# Altium project PCB_Project_HydroPore.PrjPcb
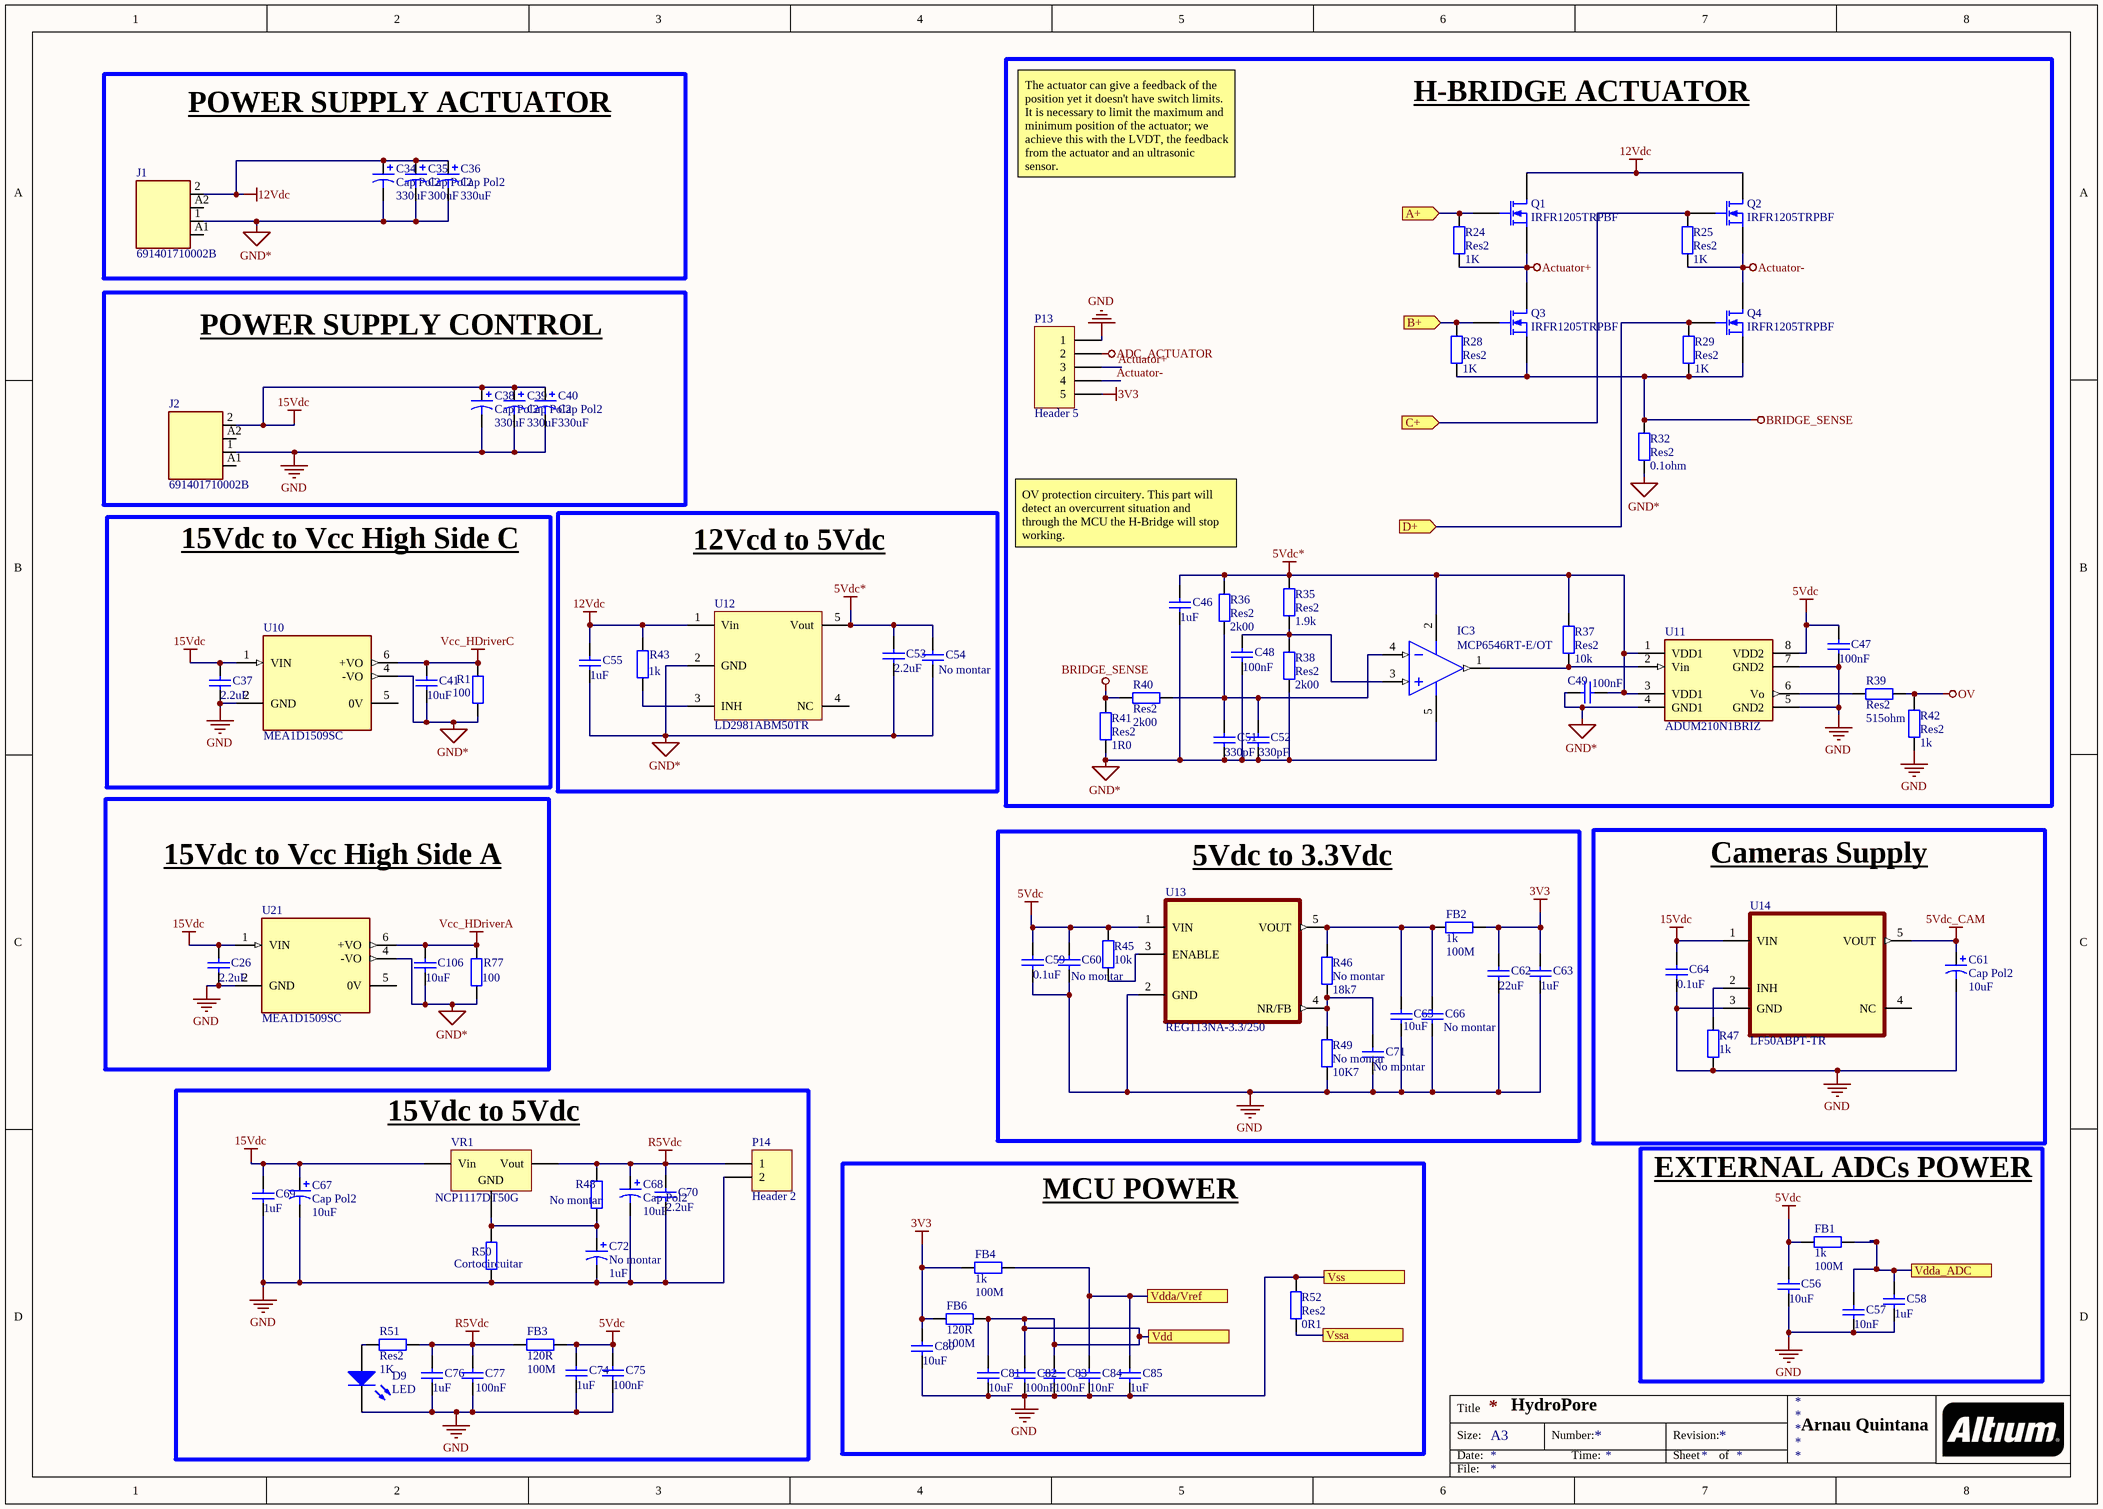
[diagram p0: Power.SchDoc]
3 sheets, 268 parts. Net scope: flat (ports and power ports of the same name join across sheets).
Board file: PCB_HydroPore.PcbDoc
Sheets:
  Power.SchDoc
  MCU.SchDoc
  Sensors.SchDoc

## Sheet Power.SchDoc
size A3

### Parts
C26  value 2.2uF  [0603 - duplicate]  (hidden comment: Cap)
C34  Cap Pol2  value 330uF  [ElectrolythicCap_5mm]
C35  Cap Pol2  value 300uF  [ElectrolythicCap_5mm]
C36  Cap Pol2  value 330uF  [ElectrolythicCap_5mm]
C37  value 2.2uF  [0603 - duplicate]  (hidden comment: Cap)
C38  Cap Pol2  value 330uF  [ElectrolythicCap_5mm]
C39  Cap Pol2  value 330uF  [ElectrolythicCap_5mm]
C40  Cap Pol2  value 330uF  [ElectrolythicCap_5mm]
C41  value 10uF  [0603 - duplicate]  (hidden comment: Cap)
C46  value 1uF  [0603 - duplicate]  (hidden comment: Cap)
C47  value 100nF  [0603 - duplicate]  (hidden comment: Cap)
C48  value 100nF  [0603 - duplicate]  (hidden comment: Cap)
C49  value 100nF  [0603 - duplicate]  (hidden comment: Cap)
C51  value 330pF  [0603 - duplicate]  (hidden comment: Cap)
C52  value 330pF  [0603 - duplicate]  (hidden comment: Cap)
C53  value 2.2uF  [0603 - duplicate]  (hidden comment: Cap)
C54  No montar  [0603 - duplicate]
C55  value 1uF  [0603 - duplicate]  (hidden comment: Cap)
C56  value 10uF  [0603 - duplicate]  (hidden comment: Cap)
C57  value 10nF  [0603 - duplicate]  (hidden comment: Cap)
C58  value 1uF  [0603 - duplicate]  (hidden comment: Cap)
C59  value 0.1uF  [0603 - duplicate]  (hidden comment: Cap)
C60  No montar  [0603 - duplicate]
C61  Cap Pol2  value 10uF  [ElectrolythicCap_2mm]
C62  value 22uF  [0603 - duplicate]  (hidden comment: Cap)
C63  value 1uF  [0603 - duplicate]  (hidden comment: Cap)
C64  value 0.1uF  [0603 - duplicate]  (hidden comment: Cap)
C65  10uF  [0603 - duplicate]
C66  No montar  [0603 - duplicate]
C67  Cap Pol2  value 10uF  [ElectrolythicCap_2mm]
C68  Cap Pol2  value 10uF  [ElectrolythicCap_2mm]
C69  value 1uF  [0603 - duplicate]  (hidden comment: Cap)
C70  value 2.2uF  [0603 - duplicate]  (hidden comment: Cap)
C71  value No montar  [0603 - duplicate]  (hidden comment: 0.01uF)
C72  No montar  value 1uF  [ElectrolythicCap_2mm]
C74  value 1uF  [0603 - duplicate]  (hidden comment: Cap)
C75  value 100nF  [0603 - duplicate]  (hidden comment: Cap)
C76  value 1uF  [0603 - duplicate]  (hidden comment: Cap)
C77  value 100nF  [0603 - duplicate]  (hidden comment: Cap)
C80  value 10uF  [0603 - duplicate]  (hidden comment: Cap)
C81  value 10uF  [0603 - duplicate]  (hidden comment: Cap)
C82  value 100nF  [0603 - duplicate]  (hidden comment: Cap)
C83  value 100nF  [0603 - duplicate]  (hidden comment: Cap)
C84  value 10nF  [0603 - duplicate]  (hidden comment: Cap)
C85  value 1uF  [0603 - duplicate]  (hidden comment: Cap)
C106  value 10uF  [0603 - duplicate]  (hidden comment: Cap)
D9  LED  [LED 1206]
FB1  1k  value 100M  [0603 - duplicate]
FB2  1k  value 100M  [0603 - duplicate]
FB3  120R  value 100M  [0603 - duplicate]
FB4  1k  value 100M  [0603 - duplicate]
FB6  120R  value 100M  [0603 - duplicate]
IC3  MCP6546RT-E/OT  [SOT23-5_N]
J1  691401710002B  [691401710002B]
J2  691401710002B  [691401710002B]
P13  Header 5  [regleta_5]
P14  Header 2  [HDR1X2]
Q1  IRFR1205TRPBF  [Infineon_PG-TO252-3_MFG]
Q2  IRFR1205TRPBF  [Infineon_PG-TO252-3_MFG]
Q3  IRFR1205TRPBF  [Infineon_PG-TO252-3_MFG]
Q4  IRFR1205TRPBF  [Infineon_PG-TO252-3_MFG]
R1  100  [1206]
R24  Res2  value 1K  [0603 - duplicate]
R25  Res2  value 1K  [0603 - duplicate]
R28  Res2  value 1K  [0603 - duplicate]
R29  Res2  value 1K  [0603 - duplicate]
R32  Res2  value 0.1ohm  [1206]
R35  Res2  value 1.9k  [0603 - duplicate]
R36  Res2  value 2k00  [0603 - duplicate]
R37  Res2  value 10k  [0603 - duplicate]
R38  Res2  value 2k00  [0603 - duplicate]
R39  Res2  value 515ohm  [0603 - duplicate]
R40  Res2  value 2k00  [0603 - duplicate]
R41  Res2  value 1R0  [1206]
R42  Res2  value 1k  [0603 - duplicate]
R43  1k  [0603 - duplicate]
R45  10k  [0603 - duplicate]
R46  No montar  value 18k7  [0603 - duplicate]
R47  1k  [0603 - duplicate]
R48  No montar  [0603 - duplicate]
R49  No montar  value 10K7  [0603 - duplicate]
R50  Cortocircuitar  [0603 - duplicate]
R51  Res2  value 1K  [0603 - duplicate]
R52  Res2  value 0R1  [0603 - duplicate]
R77  100  [1206]
U10  MEA1D1509SC  [CONV_MEA1D1509SC]
U11  ADUM210N1BRIZ  [SOIC127P1031X265-8N]
U12  LD2981ABM50TR  [SOT23-5_N]
U13  REG113NA-3.3/250  [SOT23-5_N]
U14  LF50ABPT-TR  [DPAK114P990X239-6N]
U21  MEA1D1509SC  [CONV_MEA1D1509SC]
VR1  NCP1117DT50G  [D2PAK_N]

### Blocks framed on the sheet
H-BRIDGE ACTUATOR: C46-C49 C51 C52 IC3 P13 Q1-Q4 R24 R25 R28 R29 R32 R35-R42 U11
POWER SUPPLY ACTUATOR: C34-C36 J1
POWER SUPPLY CONTROL: C38-C40 J2
15Vdc to Vcc High Side C: C37 C41 R1 U10
12Vcd to 5Vdc: C53-C55 R43 U12
15Vdc to Vcc High Side A: C26 C106 R77 U21
5Vdc to 3.3Vdc: C59 C60 C62 C63 C65 C66 C71 FB2 R45 R46 R49 U13
Cameras Supply: C61 C64 R47 U14
15Vdc to 5Vdc: C67-C70 C72 C74-C77 D9 FB3 P14 R48 R50 R51 VR1
EXTERNAL ADCs POWER: C56-C58 FB1
MCU POWER: C80-C85 FB4 FB6 R52

### Ports
A+ (in), B+ (in), C+ (in), D+ (in), Vdd, Vdda/Vref, Vdda_ADC, Vss, Vssa

### Nets
3V3: C62.2 C63.2 C80.2 FB2.2 FB4.1 FB6.1 P13.5
5Vdc: C47.2 C56.2 C59.2 C60.2 C74.2 C75.2 FB1.1 FB3.2 R45.2 U11.8(VDD2) U13.1(VIN)
5Vdc*: C46.2 C49.1 C53.2 C54.2 IC3.2(V+) R35.1 R36.1 R37.2 U11.1(VDD1) U11.3(VDD1) U12.5(Vout)
5Vdc_CAM: C61.P U14.5(VOUT)
12Vdc: C34.P C35.P C36.P C55.2 J1.2 Q1.2(D) Q2.2(D) R43.2 U12.1(Vin)
15Vdc: C26.2 C37.2 C38.P C39.P C40.P C64.2 C67.P C69.2 J2.2 U10.1(VIN) U14.1(VIN) U21.1(VIN) VR1.3(Vin)
Actuator+: P13.3 Q1.3(S) Q3.2(D) R24.1
Actuator-: P13.4 Q2.3(S) Q4.2(D) R25.1
ADC_ACTUATOR: P13.2
BRIDGE_SENSE: Q3.3(S) Q4.3(S) R28.1 R29.1 R32.2 R40.1 R41.2
GND: C26.1 C37.1 C38.N C39.N C40.N C47.1 C56.1 C57.1 C58.1 C59.1 C60.1 C61.N C62.1 C63.1 C64.1 C65.1 C66.1 C67.N C68.N C69.1 C70.1 C71.1 C72.N C74.1 C75.1 C76.1 C77.1 C80.1 C81.1 C82.1 C83.1 C84.1 C85.1 D9.2(K) J2.1 P13.1 P14.2 R42.2 R47.1 R49.1 R50.1 R52.2 U10.2(GND) U11.5(GND2) U11.7(GND2) U13.2(GND) U14.3(GND) U21.2(GND) ; port Vss
GND*: C34.N C35.N C36.N C41.1 C46.1 C48.1 C49.2 C51.1 C52.1 C53.1 C54.1 C55.1 C106.1 IC3.5(V-) J1.1 R1.1 R32.1 R38.2 R41.1 R77.1 U10.4(-VO) U11.4(GND1) U12.2(GND) U21.4(-VO)
OV: R39.1 R42.1
R5Vdc: C68.P C70.2 C76.2 C77.2 FB3.1 P14.1 R48.2 R51.2 VR1.2(Vout)
Vcc_HDriverA: C106.2 R77.2 U21.6(+VO)
Vcc_HDriverC: C41.2 R1.2 U10.6(+VO)
NetC42_2: C57.2 C58.2 FB1.2 ; port Vdda_ADC
NetC48_2: C48.2 IC3.3(IN+) R35.2 R38.1
NetC51_2: C51.2 C52.2 IC3.4(IN-) R36.2 R40.2
NetC65_2: C65.2 C66.2 FB2.1 R46.2 U13.5(VOUT)
NetC71_2: C71.2 R46.1 R49.2 U13.4(NR/FB)
NetC72_P: C72.P R48.1 R50.2 VR1.1(GND)
NetC81_2: C81.2 C82.2 C83.2 FB6.2 ; port Vdd
NetC84_2: C84.2 C85.2 FB4.2 ; port Vdda/Vref
NetD5_1: Q3.1(G) R28.2 ; port B+
NetD6_1: Q1.1(G) R24.2 ; port A+
NetD7_1: Q2.1(G) R25.2 ; port C+
NetD8_1: Q4.1(G) R29.2 ; port D+
NetD9_1: D9.1(A) R51.1
NetIC3_1: IC3.1(OUT) R37.1 U11.2(Vin)
NetR39_2: R39.2 U11.6(Vo)
NetR43_1: R43.1 U12.3(INH)
NetR45_1: R45.1 U13.3(ENABLE)
NetR47_2: R47.2 U14.2(INH)
NetR52_1: R52.1 ; port Vssa

Not connected (* = marked no-connect by the designer): J1 A1(2) A2(1); J2 A1(2) A2(1); U10 5(0V); U12 4(NC); U14 4(NC); U21 5(0V)

### Notes on the sheet
- The actuator can give a feedback of the position yet it doesn't have switch limits. It is necessary to limit the maximum and minimum position of the actuator; we achieve this with the LVDT, the feedback from the actuator and an ultrasonic sensor.
- OV protection circuitery. This part will detect an overcurrent situation and through the MCU the H-Bridge will stop working.
- (near U14) Cameras use their own LDO, every one of them have a consume of 100mA more less, so just for ensure a correct working we separate supplies.
- (near FB4) MCU is a critical component, before connect the 3.3V supply we need to filter and ensure that uC will not be without supply in any moment using a good number of capacitors.
- HydroPore
- Arnau Quintana
- Title
- Size:
- Date:
- A3
- Number:
- Time:
- Revision:
- Sheet
- of
- File:

### Library data of the parts
C26 C37 C41 C46-C49 C51-C60 C62-C66 C69-C71 C74-C77 C80-C85 C106 = Cap: Capacitor; Published: 8-Jun-2000; LatestRevisionDate: 17-Jul-2002; LatestRevisionNote: Re-released for DXP Platform.; PackageReference: RAD-0.3; Publisher: Altium Limited; PackageDescription: Radial Cap, Thru-Hole; 2 Leads; 0.3 in Pin Spacing
C34-C36 C38-C40 C61 C67 C68 C72 = Cap Pol2: Polarized Capacitor (Axial); Published: 8-Jun-2000; LatestRevisionDate: 17-Jul-2002; LatestRevisionNote: Re-released for DXP Platform.; PackageReference: POLAR0.8; Publisher: Altium Limited; PackageDescription: Polarized Capacitor; 2 Leads
D9 = LED: Typical RED, GREEN, YELLOW, AMBER GaAs LED; Published: 8-Jun-2000; LatestRevisionDate: 17-Jul-2002; LatestRevisionNote: Re-released for DXP Platform.; PackageVersion: Feb-2002; PackageReference: 3.2X1.6X1.1; Publisher: Altium Limited; PackageDescription: SM LED; 2 Flat Leads
FB1-FB4 FB6 R1 R24 R25 R28 R29 R32 R35-R43 R45-R52 R77 = Res2: Resistor; Published: 8-Jun-2000; LatestRevisionDate: 17-Jul-2002; LatestRevisionNote: Re-released for DXP Platform.; PackageReference: AXIAL-0.4; Publisher: Altium Limited; PackageDescription: Axial Device, Thru-Hole; 2 Leads; 0.4 in Pin Spacing
IC3 = MCP6546RT-E/OT: Operational Amplifier; Published: 8-Jun-2000; LatestRevisionDate: 17-Jul-2002; LatestRevisionNote: Re-released for DXP Platform.; DatasheetVersion: REV. B; PackageVersion: 1990; PackageReference: H-08A; Publisher: Altium Limited; PackageDescription: Can; 8 Leads; Pin Circle Dia. 5.08 mm; Lead Dia. 0.53 mm (max); ComponentLink1Description: Manufacturer Link; ComponentLink1URL: http://www.analog.com/
J1 J2 = 691401710002B: <b>WR-TBL Terminal block - serie 401 5,0mm - Spring clamp/Screw less - horizontal entry ; </b>=>Code : Con_TBL_Screwless_5.00_6914017100xxB <p><a href="http://katalog.we-online.de/media/images/eican/Con_TBL_Screwless_5.00_6914017100xxB_pf2.jpg"> <img src="http://katalog.we-online.de/media/thumbs2/eican/thb_Con_TBL_Screwless_5.00_6914017100xxB_pf2.jpg" width="320"></a><p> <p>Details see: <a href="http://katalog.we-online.de/en/em/TBL_5_00_401B_SCREWLESS_HORIZONTAL_ENTRY_2_0MM2_WIRES_6914017100XXB">http://katalog.we-online.de/en/em/TBL_5_00_401B_SCREWLESS_HORIZONTAL_ENTRY_2_0MM2_WIRES_6914017100XXB</a> <p>Created 11/27/2014, Karrer Zheng <p>2014 (C) Wurth Elektronik; MF: WÃ¼rth Elektronik; Package: None; Value: *; Purchase-URL: https://pricing.snapeda.com/search/part/691401710002B/?ref=eda; Availability: In Stock; SnapEDA_Link: https://www.snapeda.com/parts/691401710002B/Wurth+Electronics+Inc./view-part/?ref=snap; Price: None; MP: 691401710002B; Check_prices: https://www.snapeda.com/parts/691401710002B/Wurth+Electronics+Inc./view-part/?ref=eda
P13 = Header 5: Header, 5-Pin; LatestRevisionDate: 17-Jul-2002; LatestRevisionNote: Re-released for DXP Platform.; Publisher: Altium Limited
P14 = Header 2: Header, 2-Pin; LatestRevisionDate: 17-Jul-2002; LatestRevisionNote: Re-released for DXP Platform.; Publisher: Altium Limited
Q1-Q4 = IRFR1205TRPBF: N-Channel MOSFET; Published: 8-Jun-2000; LatestRevisionDate: 17-Jul-2002; LatestRevisionNote: Re-released for DXP Platform.; PackageVersion: 1995/1996; PackageReference: E3; Publisher: Altium Limited; PackageDescription: TO, Flat Index; 3 In-Line, Axial Leads; Body Dia. 4.6mm; Lead Dia. 0.5 mm (max)
U10 U21 = MEA1D1509SC: 1 W, Dual Independent Output, 7 Pin SIP, 4200 Vdc Isolation, Dc-Dc Converter; MP: VQA-S15-D15-SIP; MF: CUI Inc.; Mouser-Purchase-URL: https://snapeda.com/shop?store=Mouser&id=1237682; Price: None; SnapEDA_Link: https://www.snapeda.com/parts/VQA-S15-D15-SIP/CUI/view-part/1237682/?ref=snap; Availability: Bad; Arrow_Electronics-Purchase-URL: https://snapeda.com/shop?store=Arrow+Electronics&id=1237682; Value: *; CUI_purchase_URL: https://www.cui.com/product/dc-dc-converters/igbt-driver/vqa-series?utm_source=snapeda.com&utm_medium=referral&utm_campaign=snapedaBOM; Package: SIP-7 CUI
U11 = ADUM210N1BRIZ: Digital Isolator; MP: PEME2-S15-D5-S; MF: CUI; Purchase-URL: https://pricing.snapeda.com/search/part/PEME2-S15-D5-S/?ref=eda; Package: None; Value: *; SnapEDA_Link: https://www.snapeda.com/parts/PEME2-S15-D5-S/CUI/view-part/?ref=snap; Availability: In Stock; Price: None; Check_prices: https://www.snapeda.com/parts/PEME2-S15-D5-S/CUI/view-part/?ref=eda
U13 = REG113NA-3.3/250: Dropout Linear  Regulator; MP: LP3964EMP-ADJ; Package: None; Price: None; Value: *; Availability: Unavailable
U14 = LF50ABPT-TR: Dropout Linear  Regulator; MP: LP3964EMP-ADJ; Package: None; Price: None; Value: *; Availability: Unavailable
VR1 = Volt Reg: Published: 24-Mar-1999; LatestRevisionDate: 29-May-2009; LatestRevisionNote: IPC-7351 Footprint Added.; PackageReference: D2PAK; Publisher: Altium Limited; PackageDescription: 3-Pin Transistor Outline Package 2.54 mm Pitch, 15.1 mm Lead Span
U12 = LD2981ABM50TR: Published: 8-Jun-2000; LatestRevisionDate: 29-May-2009; LatestRevisionNote: IPC-7351 Footprint Added.; PackageVersion: May-1999; PackageReference: DB008; Publisher: Altium Limited; PackageDescription: 8-Pin Plastic Small Outline Package 0.65 mm Pitch; Code_JEDEC: MO-150-AA; Code_IPC: SOP65P780-8

## Sheet MCU.SchDoc
size A3; Organization: Altium Limited; Address1: L3, 12a Rodborough Rd; Address2: Frenchs Forest; Address3: NSW; Address4: Australia 2086
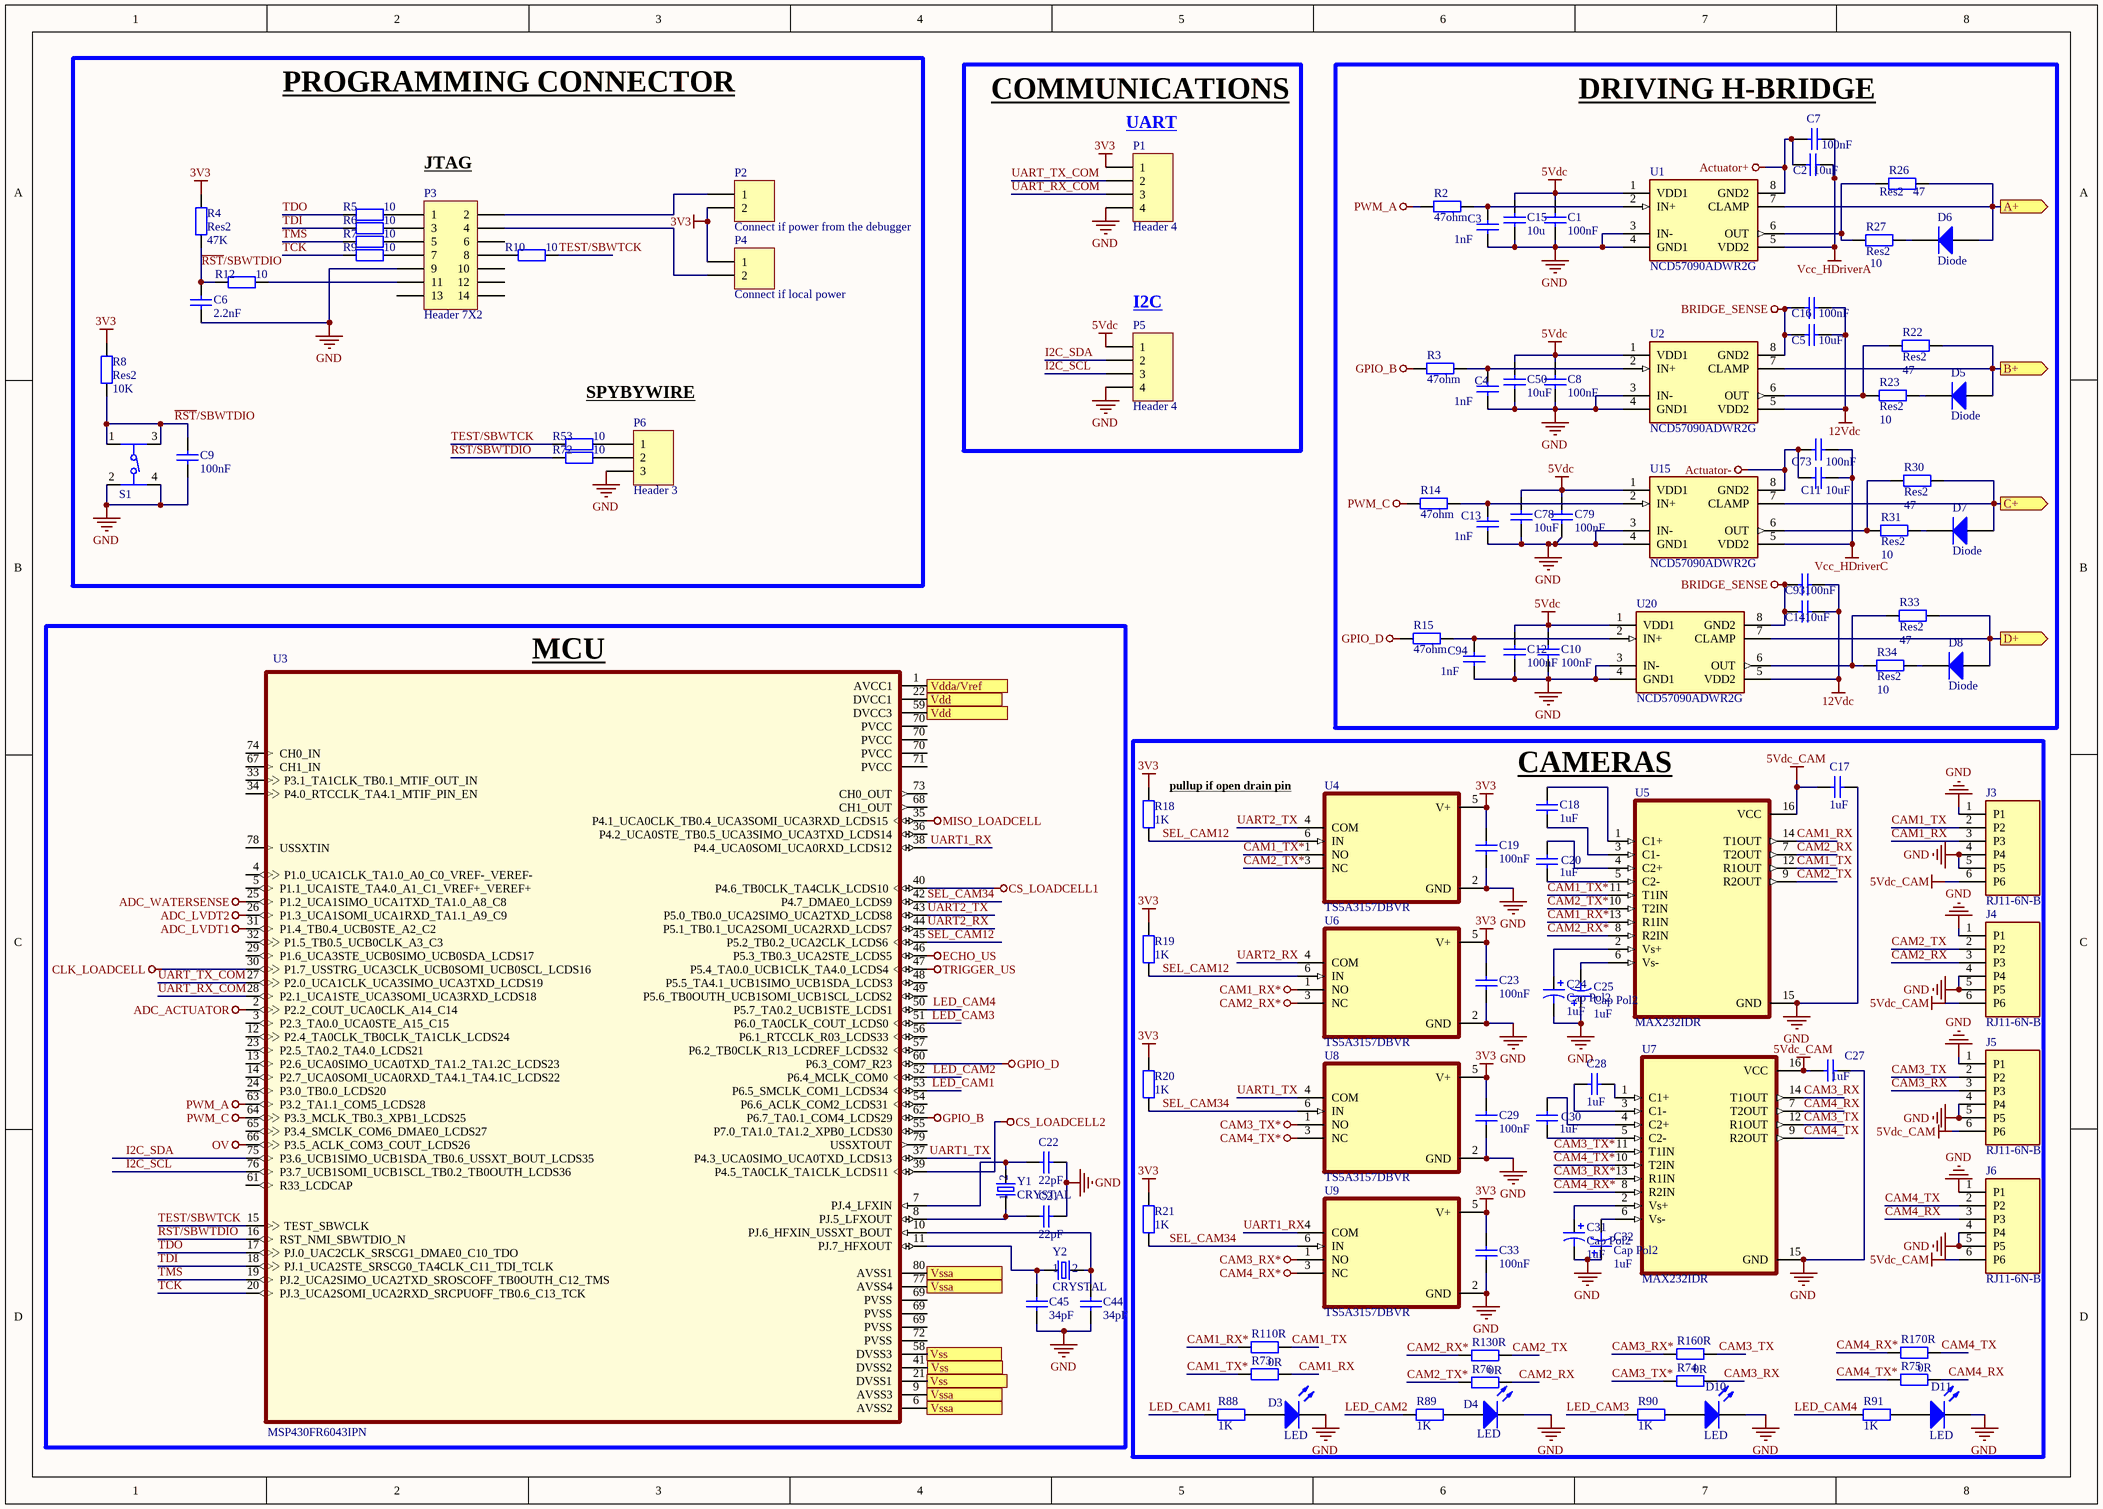
[diagram p1: MCU.SchDoc]

### Parts
C1  value 100nF  [1206]  (hidden comment: Cap)
C2  value 10uF  [1206]  (hidden comment: Cap)
C3  value 1nF  [0603 - duplicate]  (hidden comment: Cap)
C4  value 1nF  [0603 - duplicate]  (hidden comment: Cap)
C5  value 10uF  [1206]  (hidden comment: Cap)
C6  value 2.2nF  [0603 - duplicate]  (hidden comment: Cap)
C7  value 100nF  [1206]  (hidden comment: Cap)
C8  value 100nF  [1206]  (hidden comment: Cap)
C9  value 100nF  [0603 - duplicate]  (hidden comment: Cap)
C10  value 100nF  [1206]  (hidden comment: Cap)
C11  value 10uF  [1206]  (hidden comment: Cap)
C12  value 100nF  [1206]  (hidden comment: Cap)
C13  value 1nF  [0603 - duplicate]  (hidden comment: Cap)
C14  value 10uF  [1206]  (hidden comment: Cap)
C15  value 10u  [1206]  (hidden comment: Cap)
C16  value 100nF  [1206]  (hidden comment: Cap)
C17  value 1uF  [0603 - duplicate]  (hidden comment: Cap)
C18  value 1uF  [0603 - duplicate]  (hidden comment: Cap)
C19  value 100nF  [0603 - duplicate]  (hidden comment: Cap)
C20  value 1uF  [0603 - duplicate]  (hidden comment: Cap)
C21  value 22pF  [0603 - duplicate]  (hidden comment: Cap)
C22  value 22pF  [0603 - duplicate]  (hidden comment: Cap)
C23  value 100nF  [0603 - duplicate]  (hidden comment: Cap)
C24  Cap Pol2  value 1uF  [ElectrolythicCap_2mm]
C25  Cap Pol2  value 1uF  [ElectrolythicCap_2mm]
C27  value 1uF  [0603 - duplicate]  (hidden comment: Cap)
C28  value 1uF  [0603 - duplicate]  (hidden comment: Cap)
C29  value 100nF  [0603 - duplicate]  (hidden comment: Cap)
C30  value 1uF  [0603 - duplicate]  (hidden comment: Cap)
C31  Cap Pol2  value 1uF  [ElectrolythicCap_2mm]
C32  Cap Pol2  value 1uF  [ElectrolythicCap_2mm]
C33  value 100nF  [0603 - duplicate]  (hidden comment: Cap)
C44  value 34pF  [0603 - duplicate]  (hidden comment: Cap)
C45  value 34pF  [0603 - duplicate]  (hidden comment: Cap)
C50  value 10uF  [1206]  (hidden comment: Cap)
C73  value 100nF  [1206]  (hidden comment: Cap)
C78  value 10uF  [1206]  (hidden comment: Cap)
C79  value 100nF  [1206]  (hidden comment: Cap)
C93  value 100nF  [1206]  (hidden comment: Cap)
C94  value 1nF  [0603 - duplicate]  (hidden comment: Cap)
D3  LED  [LED 1206]
D4  LED  [LED 1206]
D5  Diode  [do-214ac]
D6  Diode  [do-214ac]
D7  Diode  [do-214ac]
D8  Diode  [do-214ac]
D10  LED  [LED 1206]
D11  LED  [LED 1206]
J3  RJ11-6N-B  [TE_RJ11-6N-B]
J4  RJ11-6N-B  [TE_RJ11-6N-B]
J5  RJ11-6N-B  [TE_RJ11-6N-B]
J6  RJ11-6N-B  [TE_RJ11-6N-B]
P1  Header 4  [regleta_4]
P2  Connect if power from the debugger  [HDR1X2]
P3  Header 7X2  [HDR2X7]
P4  Connect if local power  [HDR1X2]
P5  Header 4  [regleta_4]
P6  Header 3  [HDR1X3]
R2  value 47ohm  [0603 - duplicate]  (hidden comment: Res2)
R3  value 47ohm  [0603 - duplicate]  (hidden comment: Res2)
R4  Res2  value 47K  [0603 - duplicate]
R5  value 10  [0603 - duplicate]  (hidden comment: Res2)
R6  value 10  [0603 - duplicate]  (hidden comment: Res2)
R7  value 10  [0603 - duplicate]  (hidden comment: Res2)
R8  Res2  value 10K  [0603 - duplicate]
R9  value 10  [0603 - duplicate]  (hidden comment: Res2)
R10  value 10  [0603 - duplicate]  (hidden comment: Res2)
R11  value 0R  [0603 - duplicate]  (hidden comment: Res2)
R12  value 10  [0603 - duplicate]  (hidden comment: Res2)
R13  value 0R  [0603 - duplicate]  (hidden comment: Res2)
R14  value 47ohm  [0603 - duplicate]  (hidden comment: Res2)
R15  value 47ohm  [0603 - duplicate]  (hidden comment: Res2)
R16  value 0R  [0603 - duplicate]  (hidden comment: Res2)
R17  value 0R  [0603 - duplicate]  (hidden comment: Res2)
R18  value 1K  [0603 - duplicate]  (hidden comment: Res2)
R19  value 1K  [0603 - duplicate]  (hidden comment: Res2)
R20  value 1K  [0603 - duplicate]  (hidden comment: Res2)
R21  value 1K  [0603 - duplicate]  (hidden comment: Res2)
R22  Res2  value 47  [0603 - duplicate]
R23  Res2  value 10  [1206]
R26  Res2  value 47  [0603 - duplicate]
R27  Res2  value 10  [1206]
R30  Res2  value 47  [0603 - duplicate]
R31  Res2  value 10  [1206]
R33  Res2  value 47  [0603 - duplicate]
R34  Res2  value 10  [1206]
R53  value 10  [0603 - duplicate]  (hidden comment: Res2)
R72  value 10  [0603 - duplicate]  (hidden comment: Res2)
R73  value 0R  [0603 - duplicate]  (hidden comment: Res2)
R74  value 0R  [0603 - duplicate]  (hidden comment: Res2)
R75  value 0R  [0603 - duplicate]  (hidden comment: Res2)
R76  value 0R  [0603 - duplicate]  (hidden comment: Res2)
R88  value 1K  [0603 - duplicate]  (hidden comment: Res2)
R89  value 1K  [0603 - duplicate]  (hidden comment: Res2)
R90  value 1K  [0603 - duplicate]  (hidden comment: Res2)
R91  value 1K  [0603 - duplicate]  (hidden comment: Res2)
S1  430182070816  [430182070816]  (value not drawn)
U1  NCD57090ADWR2G  [soic8_w]
U2  NCD57090ADWR2G  [soic8_w]
U3  MSP430FR6043IPN  [*QFP50P1400X1400X160-80N]
U4  TS5A3157DBVR  [SOT95P280X145-6N]
U5  MAX232IDR  [SOIC127P600X175-16N]
U6  TS5A3157DBVR  [SOT95P280X145-6N]
U7  MAX232IDR  [SOIC127P600X175-16N]
U8  TS5A3157DBVR  [SOT95P280X145-6N]
U9  TS5A3157DBVR  [SOT95P280X145-6N]
U15  NCD57090ADWR2G  [soic8_w]
U20  NCD57090ADWR2G  [soic8_w]
Y1  CRYSTAL  [XTAL320X150X90]
Y2  CRYSTAL  [XTAL_ABM7-16.000MHZ-D2Y-T]

### Blocks framed on the sheet
PROGRAMMING CONNECTOR: C6 C9 P2-P4 P6 R4-R10 R12 R53 R72 S1
COMMUNICATIONS: P1 P5
DRIVING H-BRIDGE: C1-C5 C7 C8 C10-C16 C50 C73 C78 C79 C93 C94 D5-D8 R2 R3 R14 R15 R22 R23 R26 R27 R30 R31 R33 R34 U1 U2 U15 U20
MCU: C21 C22 C44 C45 U3 Y1 Y2
CAMERAS: C17-C20 C23-C25 C27-C33 D3 D4 D10 D11 J3-J6 R11 R13 R16-R21 R73-R76 R88-R91 U4-U9

### Ports
A+ (out), B+ (out), C+ (out), D+ (out), Vdd, Vdda/Vref, Vss, Vssa

### Nets
3V3: C19.2 C23.2 C29.2 C33.2 P1.1 P2.2 P4.1 R4.2 R8.2 R18.1 R19.1 R20.1 R21.1 U4.5(V+) U6.5(V+) U8.5(V+) U9.5(V+)
5Vdc: C1.1 C8.2 C10.1 C12.1 C15.1 C50.2 C78.2 C79.2 P5.1 U1.1(VDD1) U2.1(VDD1) U15.1(VDD1) U20.1(VDD1)
5Vdc_CAM: C17.2 C27.2 J3.6(P6) J4.6(P6) J5.6(P6) J6.6(P6) U5.16(VCC) U7.16(VCC)
12Vdc: C5.1 C14.1 C16.1 C93.1 U2.5(VDD2) U20.5(VDD2)
Actuator+: C2.2 C7.2 U1.8(GND2)
Actuator-: C11.2 C73.2 U15.8(GND2)
ADC_ACTUATOR: U3.2(P2.2_COUT_UCA0CLK_A14_C14)
ADC_LVDT1: U3.31(P1.4_TB0.4_UCB0STE_A2_C2)
ADC_LVDT2: U3.26(P1.3_UCA1SOMI_UCA1RXD_TA1.1_A9_C9)
ADC_WATERSENSE: U3.25(P1.2_UCA1SIMO_UCA1TXD_TA1.0_A8_C8)
BRIDGE_SENSE: C5.2 C14.2 C16.2 C93.2 U2.8(GND2) U20.8(GND2)
CAM1_RX*: R11.1 U5.13(R1IN) U6.1(NO)
CAM2_RX*: R13.1 U5.8(R2IN) U6.3(NC)
CAM3_RX*: R16.1 U7.13(R1IN) U9.1(NO)
CAM3_TX*: R74.1 U7.11(T1IN) U8.1(NO)
CAM4_RX*: R17.1 U7.8(R2IN) U9.3(NC)
CAM4_TX*: R75.1 U7.10(T2IN) U8.3(NC)
CLK_LOADCELL: U3.30(P1.7_USSTRG_UCA3CLK_UCB0SOMI_UCB0SCL_LCDS16)
CS_LOADCELL1: U3.40(P4.6_TB0CLK_TA4CLK_LCDS10)
CS_LOADCELL2: U3.39(P4.5_TA0CLK_TA1CLK_LCDS11)
ECHO_US: U3.46(P5.3_TB0.3_UCA2STE_LCDS5)
GND: C1.2 C3.2 C4.2 C6.1 C8.1 C9.1 C10.2 C12.2 C13.2 C15.2 C17.1 C19.1 C21.1 C22.1 C23.1 C24.N C25.P C27.1 C29.1 C31.N C32.P C33.1 C44.1 C45.1 C50.1 C78.1 C79.1 C94.2 D3.2(K) D4.2(K) D10.2(K) D11.2(K) J3.1(P1) J3.4(P4) J3.5(P5) J4.1(P1) J4.4(P4) J4.5(P5) J5.1(P1) J5.4(P4) J5.5(P5) J6.1(P1) J6.4(P4) J6.5(P5) P1.4 P3.9 P5.4 P6.3 S1.2 S1.4 U1.3(IN-) U1.4(GND1) U2.3(IN-) U2.4(GND1) U3.21(DVSS1) U3.41(DVSS2) U3.58(DVSS3) U4.2(GND) U5.15(GND) U6.2(GND) U7.15(GND) U8.2(GND) U9.2(GND) U15.3(IN-) U15.4(GND1) U20.3(IN-) U20.4(GND1) ; port Vss
GPIO_B: R3.2 U3.62(P6.7_TA0.1_COM4_LCDS29)
GPIO_D: R15.2 U3.60(P6.3_COM7_R23)
MISO_LOADCELL: U3.35(P4.1_UCA0CLK_TB0.4_UCA3SOMI_UCA3RXD_LCDS15)
OV: U3.66(P3.5_ACLK_COM3_COUT_LCDS26)
PWM_A: R2.2 U3.63(P3.2_TA1.1_COM5_LCDS28)
PWM_C: R14.2 U3.64(P3.3_MCLK_TB0.3_XPB1_LCDS25)
TRIGGER_US: U3.47(P5.4_TA0.0_UCB1CLK_TA4.0_LCDS4)
Vcc_HDriverA: C2.1 C7.1 U1.5(VDD2)
Vcc_HDriverC: C11.1 C73.1 U15.5(VDD2)
~{RST}/SBWTDIO: C6.2 C9.2 R4.1 R8.1 R12.2 R72.2 S1.1 S1.3 U3.16(RST_NMI_SBWTDIO_N)
CAM1_RX: J3.3(P3) R73.2 U5.14(T1OUT)
CAM1_TX: J3.2(P2) R11.2 U5.12(R1OUT)
CAM1_TX*: R73.1 U4.1(NO) U5.11(T1IN)
CAM2_RX: J4.3(P3) R76.2 U5.7(T2OUT)
CAM2_TX: J4.2(P2) R13.2 U5.9(R2OUT)
CAM2_TX*: R76.1 U4.3(NC) U5.10(T2IN)
CAM3_RX: J5.3(P3) R74.2 U7.14(T1OUT)
CAM3_TX: J5.2(P2) R16.2 U7.12(R1OUT)
CAM4_RX: J6.3(P3) R75.2 U7.7(T2OUT)
CAM4_TX: J6.2(P2) R17.2 U7.9(R2OUT)
I2C_SCL: P5.3 U3.76(P3.7_UCB1SOMI_UCB1SCL_TB0.2_TB0OUTH_LCDS36)
I2C_SDA: P5.2 U3.75(P3.6_UCB1SIMO_UCB1SDA_TB0.6_USSXT_BOUT_LCDS35)
LED_CAM1: R88.1 U3.53(P6.5_SMCLK_COM1_LCDS34)
LED_CAM2: R89.1 U3.52(P6.4_MCLK_COM0)
LED_CAM3: R90.1 U3.51(P6.0_TA0CLK_COUT_LCDS0)
LED_CAM4: R91.1 U3.50(P5.7_TA0.2_UCB1STE_LCDS1)
SEL_CAM12: R18.2 R19.2 U3.45(P5.2_TB0.2_UCA2CLK_LCDS6) U4.6(IN) U6.6(IN)
SEL_CAM34: R20.2 R21.2 U3.42(P4.7_DMAE0_LCDS9) U8.6(IN) U9.6(IN)
TCK: R9.2 U3.20(PJ.3_UCA2SOMI_UCA2RXD_SRCPUOFF_TB0.6_C13_TCK)
TDI: R6.2 U3.18(PJ.1_UCA2STE_SRSCG0_TA4CLK_C11_TDI_TCLK)
TDO: R5.2 U3.17(PJ.0_UAC2CLK_SRSCG1_DMAE0_C10_TDO)
TEST/SBWTCK: R10.1 R53.2 U3.15(TEST_SBWCLK)
TMS: R7.2 U3.19(PJ.2_UCA2SIMO_UCA2TXD_SROSCOFF_TB0OUTH_C12_TMS)
UART1_RX: U3.38(P4.4_UCA0SOMI_UCA0RXD_LCDS12) U9.4(COM)
UART1_TX: U3.37(P4.3_UCA0SIMO_UCA0TXD_LCDS13) U8.4(COM)
UART2_RX: U3.44(P5.1_TB0.1_UCA2SOMI_UCA2RXD_LCDS7) U6.4(COM)
UART2_TX: U3.43(P5.0_TB0.0_UCA2SIMO_UCA2TXD_LCDS8) U4.4(COM)
UART_RX_COM: P1.3 U3.28(P2.1_UCA1STE_UCA3SOMI_UCA3RXD_LCDS18)
UART_TX_COM: P1.2 U3.27(P2.0_UCA1CLK_UCA3SIMO_UCA3TXD_LCDS19)
NetC3_1: C3.1 R2.1 U1.2(IN+)
NetC4_1: C4.1 R3.1 U2.2(IN+)
NetC13_1: C13.1 R14.1 U15.2(IN+)
NetC18_1: C18.1 U5.1(C1+)
NetC18_2: C18.2 U5.3(C1-)
NetC20_1: C20.1 U5.4(C2+)
NetC20_2: C20.2 U5.5(C2-)
NetC21_2: C21.2 U3.8(PJ.5_LFXOUT) Y1.1
NetC22_2: C22.2 U3.7(PJ.4_LFXIN) Y1.2
NetC24_P: C24.P U5.2(Vs+)
NetC25_N: C25.N U5.6(Vs-)
NetC28_1: C28.1 U7.3(C1-)
NetC28_2: C28.2 U7.1(C1+)
NetC30_1: C30.1 U7.4(C2+)
NetC30_2: C30.2 U7.5(C2-)
NetC31_P: C31.P U7.2(Vs+)
NetC32_N: C32.N U7.6(Vs-)
NetC44_2: C44.2 U3.10(PJ.6_HFXIN_USSXT_BOUT) Y2.2
NetC45_2: C45.2 U3.11(PJ.7_HFXOUT) Y2.1
NetC81_2: U3.22(DVCC1) U3.59(DVCC3) ; port Vdd
NetC84_2: U3.1(AVCC1) ; port Vdda/Vref
NetC94_1: C94.1 R15.1 U20.2(IN+)
NetD3_1: D3.1(A) R88.2
NetD4_1: D4.1(A) R89.2
NetD5_1: D5.1(A) R22.2 U2.7(CLAMP) ; port B+
NetD5_2: D5.2(K) R23.2
NetD6_1: D6.1(A) R26.2 U1.7(CLAMP) ; port A+
NetD6_2: D6.2(K) R27.2
NetD7_1: D7.1(A) R30.2 U15.7(CLAMP) ; port C+
NetD7_2: D7.2(K) R31.2
NetD8_1: D8.1(A) R33.2 U20.7(CLAMP) ; port D+
NetD8_2: D8.2(K) R34.2
NetD10_1: D10.1(A) R90.2
NetD11_1: D11.1(A) R91.2
NetP2_1: P2.1 P3.2
NetP3_1: P3.1 R5.1
NetP3_3: P3.3 R6.1
NetP3_4: P3.4 P4.2
NetP3_5: P3.5 R7.1
NetP3_7: P3.7 R9.1
NetP3_8: P3.8 R10.2
NetP3_11: P3.11 R12.1
NetP6_1: P6.1 R53.1
NetP6_2: P6.2 R72.1
NetR22_1: R22.1 R23.1 U2.6(OUT)
NetR26_1: R26.1 R27.1 U1.6(OUT)
NetR30_1: R30.1 R31.1 U15.6(OUT)
NetR33_1: R33.1 R34.1 U20.6(OUT)
NetR52_1: U3.6(AVSS2) U3.9(AVSS3) U3.77(AVSS4) U3.80(AVSS1) ; port Vssa

Not connected (* = marked no-connect by the designer): P3 6 10 12 13 14; U3 3(P2.3_TA0.0_UCA0STE_A15_C15) 4(P1.0_UCA1CLK_TA1.0_A0_C0_VREF-_VEREF-) 5(P1.1_UCA1STE_TA4.0_A1_C1_VREF+_VEREF+) 12(P2.4_TA0CLK_TB0CLK_TA1CLK_LCDS24) 13(P2.6_UCA0SIMO_UCA0TXD_TA1.2_TA1.2C_LCDS23) 14(P2.7_UCA0SOMI_UCA0RXD_TA4.1_TA4.1C_LCDS22) 23(P2.5_TA0.2_TA4.0_LCDS21) 24(P3.0_TB0.0_LCDS20) 29(P1.6_UCA3STE_UCB0SIMO_UCB0SDA_LCDS17) 32(P1.5_TB0.5_UCB0CLK_A3_C3) 33(P3.1_TA1CLK_TB0.1_MTIF_OUT_IN) 34(P4.0_RTCCLK_TA4.1_MTIF_PIN_EN) 36(P4.2_UCA0STE_TB0.5_UCA3SIMO_UCA3TXD_LCDS14) 48(P5.5_TA4.1_UCB1SIMO_UCB1SDA_LCDS3) 49(P5.6_TB0OUTH_UCB1SOMI_UCB1SCL_LCDS2) 54(P6.6_ACLK_COM2_LCDS31) 55(P7.0_TA1.0_TA1.2_XPB0_LCDS30) 56(P6.1_RTCCLK_R03_LCDS33) 57(P6.2_TB0CLK_R13_LCDREF_LCDS32) 61(R33_LCDCAP) 65(P3.4_SMCLK_COM6_DMAE0_LCDS27) 67(CH1_IN) 68(CH1_OUT) 69(PVSS) 70(PVCC) 71(PVCC) 72(PVSS) 73(CH0_OUT) 74(CH0_IN) 78(USSXTIN) 79(USSXTOUT)

### Notes on the sheet
- We will have two options to program the uC. We only need one, so we have to solder only 2 of the 4 zero ohm resistors, two of one of the two connectors.
- JTAG
- (near P1) UART
- (near P5) I2C
- SPYBYWIRE
- pullup if open drain pin
- Title
- Size:
- Date:
- A3
- Number:
- Time:
- Revision:
- Sheet
- of
- File:

### Library data of the parts
C1-C23 C27-C30 C33 C44 C45 C50 C73 C78 C79 C93 C94 = Cap: Capacitor; Published: 8-Jun-2000; LatestRevisionDate: 17-Jul-2002; LatestRevisionNote: Re-released for DXP Platform.; PackageReference: RAD-0.3; Publisher: Altium Limited; PackageDescription: Radial Cap, Thru-Hole; 2 Leads; 0.3 in Pin Spacing
C24 C25 C31 C32 = Cap Pol2: Polarized Capacitor (Axial); Published: 8-Jun-2000; LatestRevisionDate: 17-Jul-2002; LatestRevisionNote: Re-released for DXP Platform.; PackageReference: POLAR0.8; Publisher: Altium Limited; PackageDescription: Polarized Capacitor; 2 Leads
D3 D4 D10 D11 = LED: as D9 on sheet Power; Published: 8-Jun-2000; LatestRevisionDate: 17-Jul-2002; LatestRevisionNote: Re-released for DXP Platform.; PackageVersion: Feb-2002; PackageReference: 3.2X1.6X1.1; Publisher: Altium Limited; PackageDescription: SM LED; 2 Flat Leads
D5-D8 = Diode: Default Diode; Published: 8-Jun-2000; LatestRevisionDate: 17-Jul-2002; LatestRevisionNote: Re-released for DXP Platform.; PackageVersion: Sep-1996; PackageReference: SMC; Publisher: Altium Limited; PackageDescription: DO-214-AB/SMC; 2 C-Bend Leads; Body 7.9 x 5.9 mm, inc. leads (LxW); Code_JEDEC: DO-214-AB
J3-J6 = RJ11-6N-B: 6 Position 1 Port Right Angle RJ11 Low Profile Filtered EMI/RFI Modular Jack; MF: TE Connectivity; MP: RJ11-6N-B; Availability: Unavailable; SnapEDA_Link: https://www.snapeda.com/parts/RJ11-6N-B/TE%20Connectivity%20Corcom%20Filters/view-part/2771781/?ref=snap; Package: None; Price: None; TE_purchase_URL: https://www.te.com/usa-en/product-6609212-4.html?te_bu=Cor&te_type=disp&te_campaign=seda_glo_cor-seda-global-disp-prtnr-fy19-seda-model-bom-cta_sma-317_1&elqCampaignId=32493; Value: *
P1 P5 = Header 4: Header, 4-Pin; LatestRevisionDate: 17-Jul-2002; LatestRevisionNote: Re-released for DXP Platform.; Publisher: Altium Limited
P2 P4 = Header 2: Header, 2-Pin; LatestRevisionDate: 17-Jul-2002; LatestRevisionNote: Re-released for DXP Platform.; Publisher: Altium Limited
P3 = Header 7X2: Header, 7-Pin, Dual row; LatestRevisionDate: 17-Jul-2002; LatestRevisionNote: Re-released for DXP Platform.; Publisher: Altium Limited
P6 = Header 3: Header, 3-Pin; LatestRevisionDate: 17-Jul-2002; LatestRevisionNote: Re-released for DXP Platform.; Publisher: Altium Limited
R2-R23 R26 R27 R30 R31 R33 R34 R53 R72-R76 R88-R91 = Res2: Resistor; Published: 8-Jun-2000; LatestRevisionDate: 17-Jul-2002; LatestRevisionNote: Re-released for DXP Platform.; PackageReference: AXIAL-0.4; Publisher: Altium Limited; PackageDescription: Axial Device, Thru-Hole; 2 Leads; 0.4 in Pin Spacing
S1 = 430182070816: Tactile Switch SPST-NO Top Actuated Surface Mount; MF: Wurth Electronics; SnapEDA_Link: https://www.snapeda.com/parts/430182070816/Wurth+Electronics+Inc./view-part/?ref=snap; Package: None; MP: 430182070816; Value: *; Check_prices: https://www.snapeda.com/parts/430182070816/Wurth+Electronics+Inc./view-part/?ref=eda; Availability: Not in stock; Price: None
U1 U2 U15 U20 = NCD57090ADWR2G: Mosfet Gate Driver Isolated; MP: PEME2-S15-D5-S; MF: CUI; Purchase-URL: https://pricing.snapeda.com/search/part/PEME2-S15-D5-S/?ref=eda; Package: None; Value: *; SnapEDA_Link: https://www.snapeda.com/parts/PEME2-S15-D5-S/CUI/view-part/?ref=snap; Availability: In Stock; Price: None; Check_prices: https://www.snapeda.com/parts/PEME2-S15-D5-S/CUI/view-part/?ref=eda
U3 = MSP430FR6043IPN: Ultrasonic Sensing MCU with 64KB FRAM, 12KB RAM, LCD for gas and water metering applications; MF: Texas Instruments; Price: None; Availability: In Stock; SnapEDA_Link: https://www.snapeda.com/parts/MSP430FR6043IPN/Texas+Instruments/view-part/?ref=snap; Check_prices: https://www.snapeda.com/parts/MSP430FR6043IPN/Texas+Instruments/view-part/?ref=eda; Purchase-URL: https://pricing.snapeda.com/search/part/MSP430FR6043IPN/?ref=eda; MP: MSP430FR6043IPN; Package: LQFP-80 Texas Instruments; Value: *
U5 U7 = MAX232IDR: MP: TRS202EID; Package: None; Price: None; Value: *; Availability: Unavailable
Y1 = CRYSTAL: 32.768kHz Â±30ppm Crystal 12.5pF 90 kOhms 2-SMD, No Lead; MF: EPSON; MP: FC-12M; Value: *; Package: SMD-2 EPSON; Price: None; SnapEDA_Link: https://www.snapeda.com/parts/FC-12M/EPSON/view-part/105663/?ref=snap; Availability: Unavailable
Y2 = CRYSTAL: MF: EPSON; MP: FC-12M; Value: *; Package: SMD-2 EPSON; Price: None; SnapEDA_Link: https://www.snapeda.com/parts/FC-12M/EPSON/view-part/105663/?ref=snap; Availability: Unavailable
U4 U6 U8 U9 = TS5A3157DBVR: Package: None; Price: None; Value: *; MP: TS5A3157DBVR; Availability: Unavailable

## Sheet Sensors.SchDoc
size A3; Organization: Altium Limited; Address1: L3, 12a Rodborough Rd; Address2: Frenchs Forest; Address3: NSW; Address4: Australia 2086
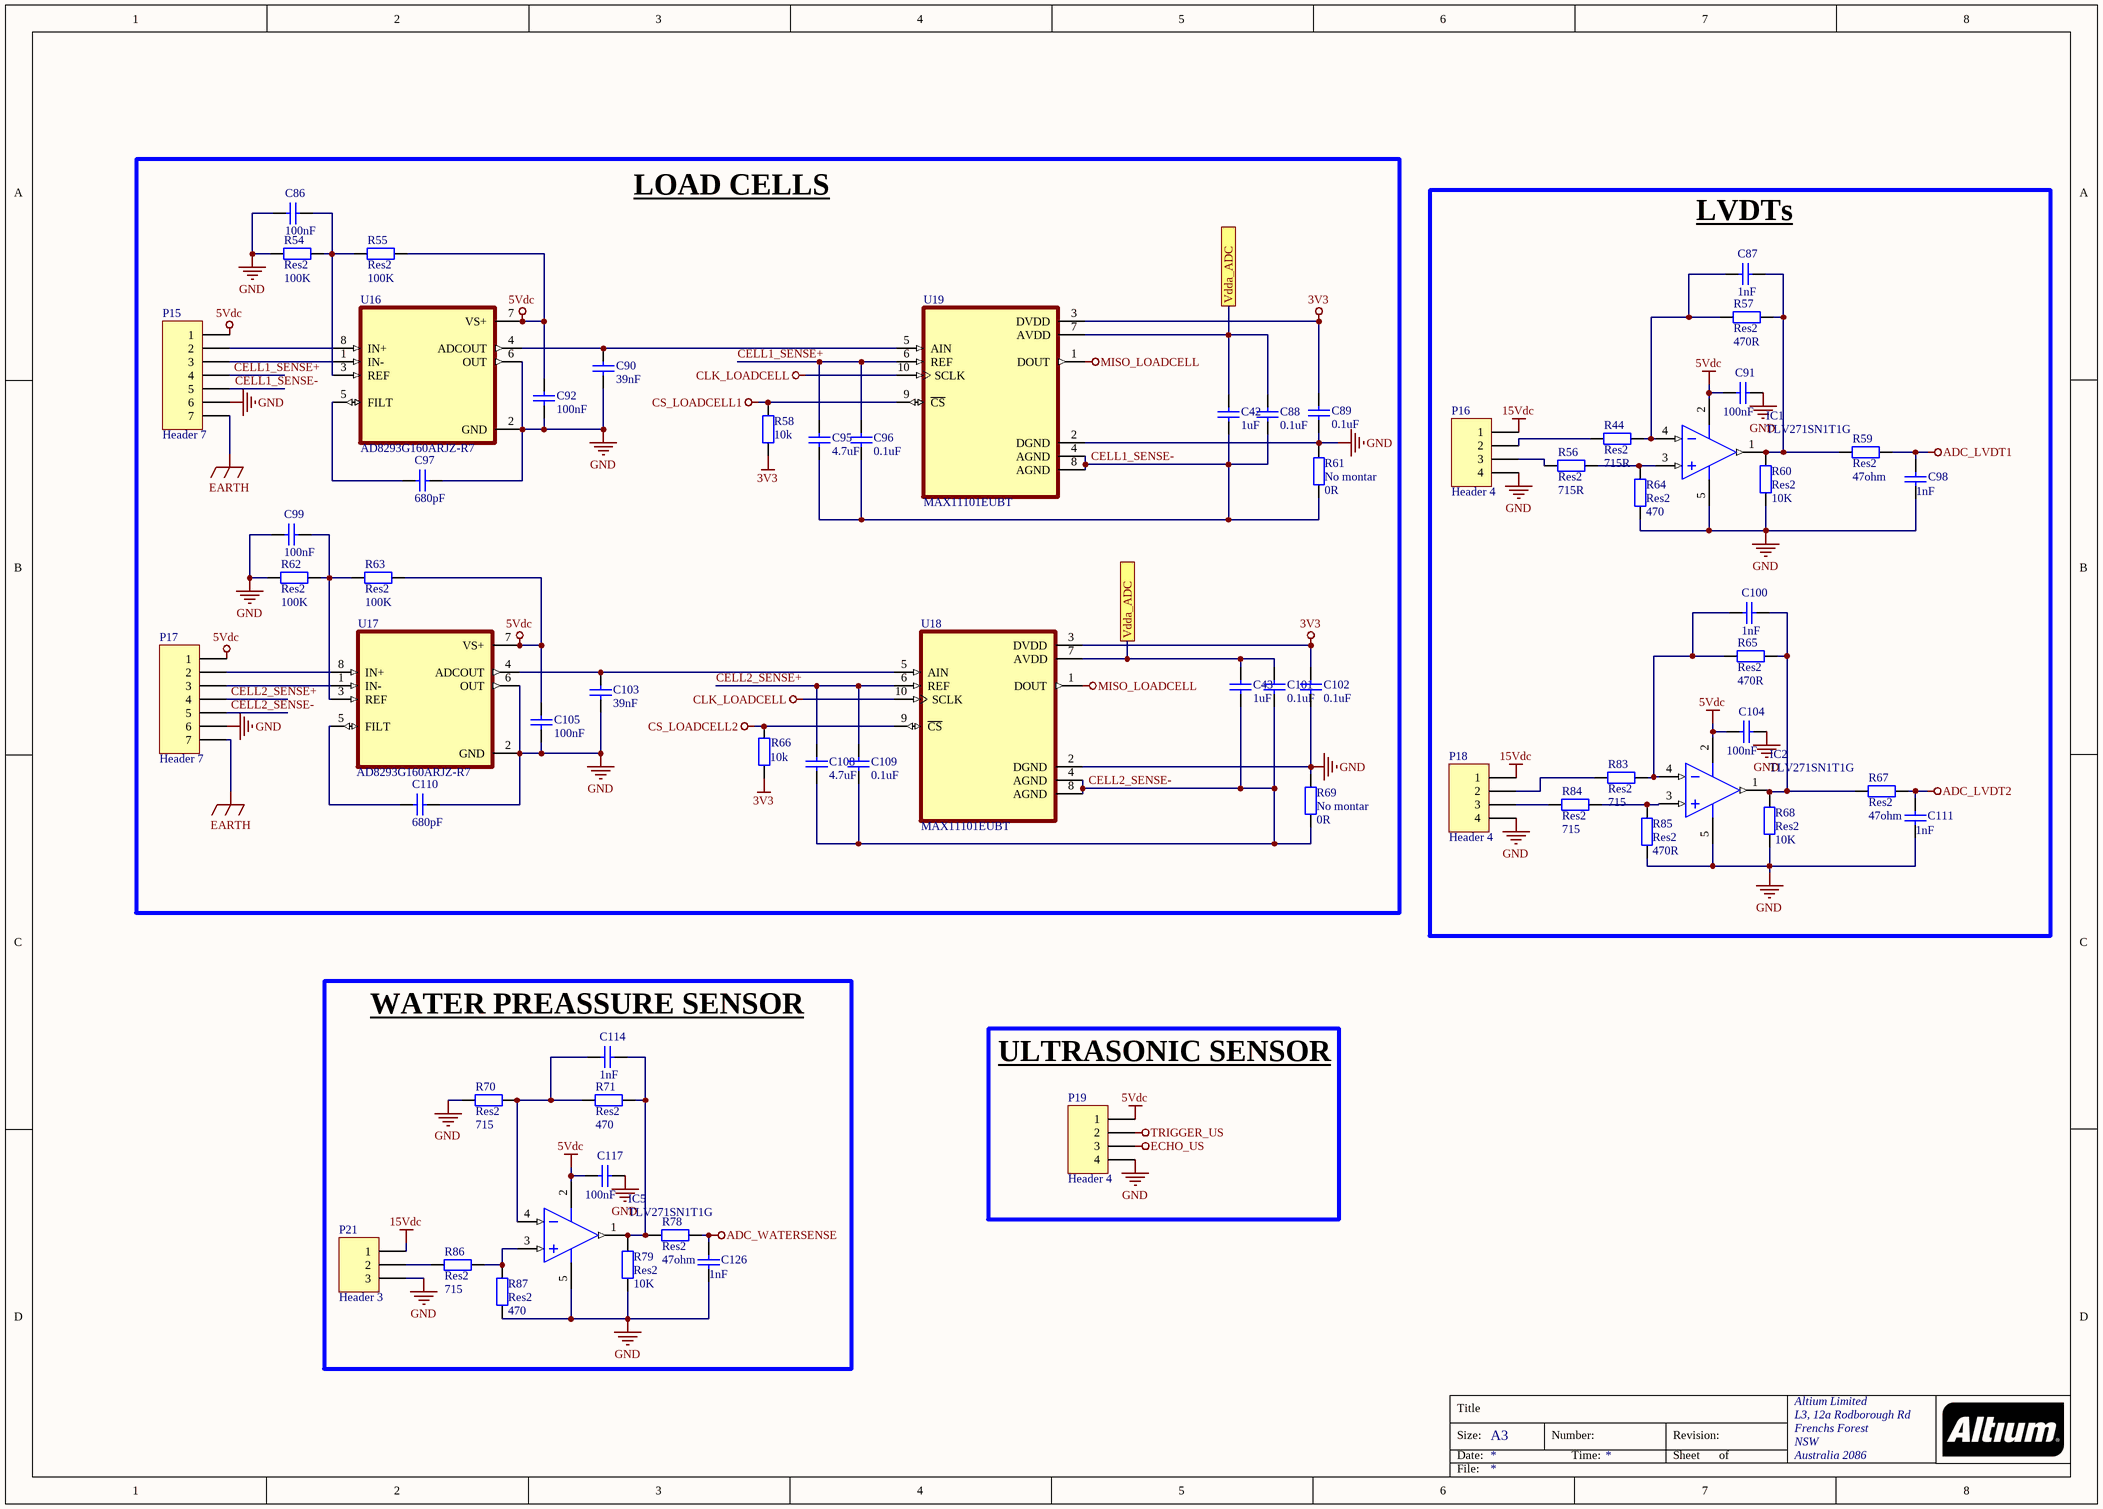
[diagram p2: Sensors.SchDoc]

### Parts
C42  value 1uF  [0603 - duplicate]  (hidden comment: Cap)
C43  value 1uF  [0603 - duplicate]  (hidden comment: Cap)
C86  value 100nF  [0603 - duplicate]  (hidden comment: Cap)
C87  value 1nF  [0603 - duplicate]  (hidden comment: Cap)
C88  value 0.1uF  [0603 - duplicate]  (hidden comment: Cap)
C89  value 0.1uF  [0603 - duplicate]  (hidden comment: Cap)
C90  value 39nF  [0603 - duplicate]  (hidden comment: Cap)
C91  value 100nF  [0603 - duplicate]  (hidden comment: Cap)
C92  value 100nF  [0603 - duplicate]  (hidden comment: Cap)
C95  value 4.7uF  [0603 - duplicate]  (hidden comment: Cap)
C96  value 0.1uF  [0603 - duplicate]  (hidden comment: Cap)
C97  value 680pF  [0603 - duplicate]  (hidden comment: Cap)
C98  value 1nF  [0603 - duplicate]  (hidden comment: Cap)
C99  value 100nF  [0603 - duplicate]  (hidden comment: Cap)
C100  value 1nF  [0603 - duplicate]  (hidden comment: Cap)
C101  value 0.1uF  [0603 - duplicate]  (hidden comment: Cap)
C102  value 0.1uF  [0603 - duplicate]  (hidden comment: Cap)
C103  value 39nF  [0603 - duplicate]  (hidden comment: Cap)
C104  value 100nF  [0603 - duplicate]  (hidden comment: Cap)
C105  value 100nF  [0603 - duplicate]  (hidden comment: Cap)
C108  value 4.7uF  [0603 - duplicate]  (hidden comment: Cap)
C109  value 0.1uF  [0603 - duplicate]  (hidden comment: Cap)
C110  value 680pF  [0603 - duplicate]  (hidden comment: Cap)
C111  value 1nF  [0603 - duplicate]  (hidden comment: Cap)
C114  value 1nF  [0603 - duplicate]  (hidden comment: Cap)
C117  value 100nF  [0603 - duplicate]  (hidden comment: Cap)
C126  value 1nF  [0603 - duplicate]  (hidden comment: Cap)
IC1  TLV271SN1T1G  [SOT23-5_N]
IC2  TLV271SN1T1G  [SOT23-5_N]
IC5  TLV271SN1T1G  [SOT23-5_N]
P15  Header 7  [regleta_7]
P16  Header 4  [regleta_4]
P17  Header 7  [regleta_7]
P18  Header 4  [regleta_4]
P19  Header 4  [regleta_4]
P21  Header 3  [regleta_3]
R44  Res2  value 715R  [0603 - duplicate]
R54  Res2  value 100K  [0603 - duplicate]
R55  Res2  value 100K  [0603 - duplicate]
R56  Res2  value 715R  [0603 - duplicate]
R57  Res2  value 470R  [0603 - duplicate]
R58  10k  [0603 - duplicate]
R59  Res2  value 47ohm  [0603 - duplicate]
R60  Res2  value 10K  [0603 - duplicate]
R61  No montar  value 0R  [0603 - duplicate]
R62  Res2  value 100K  [0603 - duplicate]
R63  Res2  value 100K  [0603 - duplicate]
R64  Res2  value 470  [0603 - duplicate]
R65  Res2  value 470R  [0603 - duplicate]
R66  10k  [0603 - duplicate]
R67  Res2  value 47ohm  [0603 - duplicate]
R68  Res2  value 10K  [0603 - duplicate]
R69  No montar  value 0R  [0603 - duplicate]
R70  Res2  value 715  [0603 - duplicate]
R71  Res2  value 470  [0603 - duplicate]
R78  Res2  value 47ohm  [0603 - duplicate]
R79  Res2  value 10K  [0603 - duplicate]
R83  Res2  value 715  [0603 - duplicate]
R84  Res2  value 715  [0603 - duplicate]
R85  Res2  value 470R  [0603 - duplicate]
R86  Res2  value 715  [0603 - duplicate]
R87  Res2  value 470  [0603 - duplicate]
U16  AD8293G160ARJZ-R7  [SOT65P280X145-8N]
U17  AD8293G160ARJZ-R7  [SOT65P280X145-8N]
U18  MAX11101EUBT  [SOP50P490X110-10N]
U19  MAX11101EUBT  [SOP50P490X110-10N]

### Blocks framed on the sheet
LOAD CELLS: C42 C43 C86 C88-C90 C92 C95-C97 C99 C101-C103 C105 C108-C110 P15 P17 R54 R55 R58 R61-R63 R66 R69 U16-U19
LVDTs: C87 C91 C98 C100 C104 C111 IC1 IC2 P16 P18 R44 R56 R57 R59 R60 R64 R65 R67 R68 R83-R85
WATER PREASSURE SENSOR: C114 C117 C126 IC5 P21 R70 R71 R78 R79 R86 R87
ULTRASONIC SENSOR: P19

### Ports
Vdda_ADC

### Nets
3V3: C89.2 C102.2 R58.2 R66.2 U18.3(DVDD) U19.3(DVDD)
5Vdc: C91.1 C92.2 C104.1 C105.2 C117.1 IC1.2(V+) IC2.2(V+) IC5.2(V+) P15.1 P17.1 P19.1 R55.1 R63.1 U16.7(VS+) U17.7(VS+)
15Vdc: P16.1 P18.1 P21.1
ADC_LVDT1: C98.2 R59.1
ADC_LVDT2: C111.2 R67.1
ADC_WATERSENSE: C126.2 R78.1
CLK_LOADCELL: U18.10(SCLK) U19.10(SCLK)
CS_LOADCELL1: R58.1 U19.9(~{CS})
CS_LOADCELL2: R66.1 U18.9(~{CS})
EARTH: P15.7 P17.7
ECHO_US: P19.3
GND: C86.2 C89.1 C90.1 C91.2 C92.1 C97.1 C98.1 C99.2 C102.1 C103.1 C104.2 C105.1 C110.1 C111.1 C117.2 C126.1 IC1.5(V-) IC2.5(V-) IC5.5(V-) P15.6 P16.4 P17.6 P18.4 P19.4 P21.3 R54.2 R60.1 R61.2 R62.2 R64.2 R68.1 R69.2 R70.2 R79.1 R85.2 R87.2 U16.2(GND) U16.6(OUT) U17.2(GND) U17.6(OUT) U18.2(DGND) U19.2(DGND)
MISO_LOADCELL: U18.1(DOUT) U19.1(DOUT)
TRIGGER_US: P19.2
CELL1_SENSE+: C95.2 C96.2 P15.4 U19.6(REF)
CELL1_SENSE-: C42.1 C88.1 C95.1 C96.1 P15.5 R61.1 U19.4(AGND) U19.8(AGND)
CELL2_SENSE+: C108.2 C109.2 P17.4 U18.6(REF)
CELL2_SENSE-: C43.1 C101.1 C108.1 C109.1 P17.5 R69.1 U18.4(AGND) U18.8(AGND)
NetC42_2: C42.2 C43.2 C88.2 C101.2 U18.7(AVDD) U19.7(AVDD) ; port Vdda_ADC
NetC86_1: C86.1 R54.1 R55.2 U16.3(REF)
NetC87_1: C87.1 IC1.1(OUT) R57.1 R59.2 R60.2
NetC87_2: C87.2 IC1.4(IN-) R44.1 R57.2
NetC90_2: C90.2 U16.4(ADCOUT) U19.5(AIN)
NetC97_2: C97.2 U16.5(FILT)
NetC99_1: C99.1 R62.1 R63.2 U17.3(REF)
NetC100_1: C100.1 IC2.1(OUT) R65.1 R67.2 R68.2
NetC100_2: C100.2 IC2.4(IN-) R65.2 R83.1
NetC103_2: C103.2 U17.4(ADCOUT) U18.5(AIN)
NetC110_2: C110.2 U17.5(FILT)
NetC114_1: C114.1 IC5.1(OUT) R71.1 R78.2 R79.2
NetC114_2: C114.2 IC5.4(IN-) R70.1 R71.2
NetIC1_3: IC1.3(IN+) R56.1 R64.1
NetIC2_3: IC2.3(IN+) R84.1 R85.1
NetIC5_3: IC5.3(IN+) R86.1 R87.1
NetP15_2: P15.2 U16.8(IN+)
NetP15_3: P15.3 U16.1(IN-)
NetP16_2: P16.2 R44.2
NetP16_3: P16.3 R56.2
NetP17_2: P17.2 U17.8(IN+)
NetP17_3: P17.3 U17.1(IN-)
NetP18_2: P18.2 R83.2
NetP18_3: P18.3 R84.2
NetP21_2: P21.2 R86.2

### Notes on the sheet
- Load cells will give a 2mV/V output, so with a 5V excitation and maxium load applied (200N), the output will be 20mV. We need to adapt this signal to be read by the ADC, so we will use an instrumentation amplifier.
- LVDTs will give an output between 0V to 5V depending on the extension of the core. We need to reduce the maximum value of 5 V to 3.3V, because pins of the MCU have a maximum tolerance. We need to use a differential amplifier to achieve that, cause the sensor will give two outputs, and we should amplify the difference between them.
- (near R70) Water sensor output is 0V to 5V. We need to reduce this value because adc pins are 3.6 tolerant. We use a resistence divisor for this purpose, and a follower because the signal will have a good voltage level but will be low power, so it can be affected by the ADC pin.
- Title
- Size:
- Date:
- A3
- Number:
- Time:
- Revision:
- Sheet
- of
- File:

### Library data of the parts
C42 C43 C86-C92 C95-C105 C108-C111 C114 C117 C126 = Cap: Capacitor; Published: 8-Jun-2000; LatestRevisionDate: 17-Jul-2002; LatestRevisionNote: Re-released for DXP Platform.; PackageReference: RAD-0.3; Publisher: Altium Limited; PackageDescription: Radial Cap, Thru-Hole; 2 Leads; 0.3 in Pin Spacing
IC1 IC2 IC5 = TLV271SN1T1G: Operational Amplifier; Published: 8-Jun-2000; LatestRevisionDate: 17-Jul-2002; LatestRevisionNote: Re-released for DXP Platform.; DatasheetVersion: REV. B; PackageVersion: 1990; PackageReference: H-08A; Publisher: Altium Limited; PackageDescription: Can; 8 Leads; Pin Circle Dia. 5.08 mm; Lead Dia. 0.53 mm (max); ComponentLink1Description: Manufacturer Link; ComponentLink1URL: http://www.analog.com/
P15 P17 = Header 7: Header, 7-Pin; LatestRevisionDate: 17-Jul-2002; LatestRevisionNote: Re-released for DXP Platform.; Publisher: Altium Limited
P16 P18 P19 = Header 4: Header, 4-Pin; LatestRevisionDate: 17-Jul-2002; LatestRevisionNote: Re-released for DXP Platform.; Publisher: Altium Limited
P21 = Header 3: Header, 3-Pin; LatestRevisionDate: 17-Jul-2002; LatestRevisionNote: Re-released for DXP Platform.; Publisher: Altium Limited
R44 R54-R71 R78 R79 R83-R87 = Res2: Resistor; Published: 8-Jun-2000; LatestRevisionDate: 17-Jul-2002; LatestRevisionNote: Re-released for DXP Platform.; PackageReference: AXIAL-0.4; Publisher: Altium Limited; PackageDescription: Axial Device, Thru-Hole; 2 Leads; 0.4 in Pin Spacing
U16 U17 = AD8293G160ARJZ-R7: Instrumentation Amplifier 1 Circuit Rail-to-Rail SOT-23-8; MF: Analog Devices; Check_prices: https://www.snapeda.com/parts/AD8293G160ARJZ-R7/Analog+Devices/view-part/?ref=eda; Value: *; Availability: In Stock; Price: None; Package: SOT-8 Analog Devices; MP: AD8293G160ARJZ-R7; Purchase-URL: https://pricing.snapeda.com/search/part/AD8293G160ARJZ-R7/?ref=eda; SnapEDA_Link: https://www.snapeda.com/parts/AD8293G160ARJZ-R7/Analog+Devices/view-part/?ref=snap
U18 U19 = MAX11101EUBT: Data acquisition IC - AD converter _ADC_ Maxim Integrated MAX11101EUB+T External uMAX 10; Value: *; MP: MAX11101EUB+T; Package: uMAX-10 Maxim; MF: Maxim Integrated; Price: None; Availability: Unavailable; SnapEDA_Link: https://www.snapeda.com/parts/MAX11101EUB%2BT/Maxim%20Integrated/view-part/693032/?ref=snap

## Nets that join several sheets
3V3: Power (7 pins), MCU (17 pins), Sensors (6 pins)
5Vdc: Power (11 pins), MCU (13 pins), Sensors (15 pins)
5Vdc_CAM: Power (C61.P U14.5), MCU (8 pins)
12Vdc: Power (9 pins), MCU (6 pins)
15Vdc: Power (13 pins), Sensors (P16.1 P18.1 P21.1)
Actuator+: Power (P13.3 Q1.3 Q3.2 R24.1), MCU (C2.2 C7.2 U1.8)
Actuator-: Power (P13.4 Q2.3 Q4.2 R25.1), MCU (C11.2 C73.2 U15.8)
ADC_ACTUATOR: Power (P13.2), MCU (U3.2)
ADC_LVDT1: MCU (U3.31), Sensors (C98.2 R59.1)
ADC_LVDT2: MCU (U3.26), Sensors (C111.2 R67.1)
ADC_WATERSENSE: MCU (U3.25), Sensors (C126.2 R78.1)
BRIDGE_SENSE: Power (7 pins), MCU (6 pins)
CLK_LOADCELL: MCU (U3.30), Sensors (U18.10 U19.10)
CS_LOADCELL1: MCU (U3.40), Sensors (R58.1 U19.9)
CS_LOADCELL2: MCU (U3.39), Sensors (R66.1 U18.9)
ECHO_US: MCU (U3.46), Sensors (P19.3)
GND: Power (48 pins), MCU (67 pins), Sensors (42 pins)
MISO_LOADCELL: MCU (U3.35), Sensors (U18.1 U19.1)
OV: Power (R39.1 R42.1), MCU (U3.66)
TRIGGER_US: MCU (U3.47), Sensors (P19.2)
Vcc_HDriverA: Power (C106.2 R77.2 U21.6), MCU (C2.1 C7.1 U1.5)
Vcc_HDriverC: Power (C41.2 R1.2 U10.6), MCU (C11.1 C73.1 U15.5)
NetC42_2: Power (C57.2 C58.2 FB1.2), Sensors (6 pins)
NetC81_2: Power (C81.2 C82.2 C83.2 FB6.2), MCU (U3.22 U3.59)
NetC84_2: Power (C84.2 C85.2 FB4.2), MCU (U3.1)
NetD5_1: Power (Q3.1 R28.2), MCU (D5.1 R22.2 U2.7)
NetD6_1: Power (Q1.1 R24.2), MCU (D6.1 R26.2 U1.7)
NetD7_1: Power (Q2.1 R25.2), MCU (D7.1 R30.2 U15.7)
NetD8_1: Power (Q4.1 R29.2), MCU (D8.1 R33.2 U20.7)
NetR52_1: Power (R52.1), MCU (U3.6 U3.9 U3.77 U3.80)